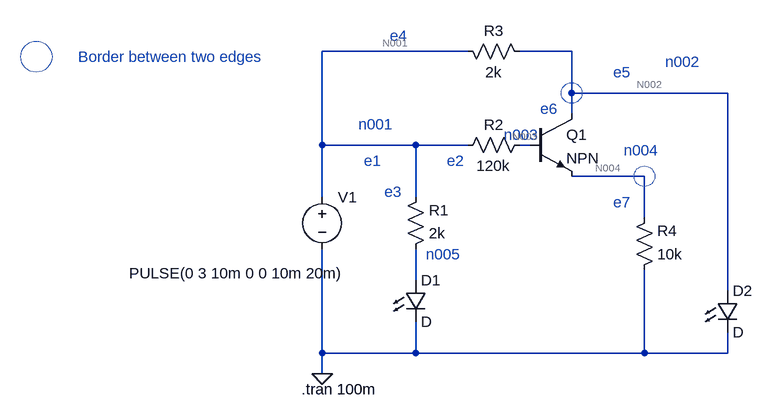
[diagram p0: schematic D-33_v-4-1_1_Tr-inverter__v2.asc]
D-33_v-4-1_1_Tr-inverter__v2.asc, the LTspice schematic file:
Version 4
SHEET 1 880 680
WIRE 192 -32 -32 -32
WIRE 352 -32 272 -32
WIRE 352 32 352 -32
WIRE 592 32 352 32
WIRE 352 64 352 32
WIRE -32 112 -32 -32
WIRE 112 112 -32 112
WIRE 192 112 112 112
WIRE 288 112 272 112
WIRE 464 160 352 160
WIRE -32 192 -32 112
WIRE 112 192 112 112
WIRE 464 224 464 160
WIRE 112 320 112 272
WIRE 592 336 592 32
WIRE -32 432 -32 272
WIRE 112 432 112 384
WIRE 112 432 -32 432
WIRE 464 432 464 304
WIRE 464 432 112 432
WIRE 592 432 592 400
WIRE 592 432 464 432
WIRE -32 464 -32 432
FLAG -32 464 0
SYMBOL npn2 288 64 R0
SYMATTR InstName Q1
SYMBOL res 96 288 M180
WINDOW 0 36 76 Left 2
WINDOW 3 36 40 Left 2
SYMATTR InstName R1
SYMATTR Value 2k
SYMBOL res 288 -16 M270
WINDOW 0 32 56 VTop 2
WINDOW 3 0 56 VBottom 2
SYMATTR InstName R3
SYMATTR Value 2k
SYMBOL res 448 320 M180
WINDOW 0 36 76 Left 2
WINDOW 3 36 40 Left 2
SYMATTR InstName R4
SYMATTR Value 10k
SYMBOL LED 96 320 R0
SYMATTR InstName D1
SYMBOL LED 576 336 R0
SYMATTR InstName D2
SYMBOL voltage -32 176 R0
WINDOW 3 -297 133 Left 2
WINDOW 123 0 0 Left 2
WINDOW 39 0 0 Left 2
SYMATTR Value PULSE(0 3 10m 0 0 10m 20m)
SYMATTR InstName V1
SYMBOL res 176 128 R270
WINDOW 0 32 56 VTop 2
WINDOW 3 0 56 VBottom 2
SYMATTR InstName R2
SYMATTR Value 120k
TEXT -64 488 Left 2 !.tran 100m
TEXT 496 -16 Left 2 ;n002
TEXT 248 96 Left 2 ;n003
TEXT 432 120 Left 2 ;n004
TEXT 24 80 Left 2 ;n001
TEXT 128 280 Left 2 ;n005
TEXT 32 136 Left 2 ;e1
TEXT 160 136 Left 2 ;e2
TEXT 64 184 Left 2 ;e3
TEXT 72 -56 Left 2 ;e4
TEXT 416 0 Left 2 ;e5
TEXT 304 56 Left 2 ;e6
TEXT 416 200 Left 2 ;e7
TEXT -408 -24 Left 2 ;Border between two edges
CIRCLE Normal 480 176 448 144 2
CIRCLE Normal 368 48 336 16 2
CIRCLE Normal -448 0 -496 -48 2

The netlist it stands for:
* D-33_v-4-1_1_Tr-inverter__v2.asc
Q1 N002 N003 N004 0 NPN
R1 N005 N001 2k
R3 N002 N001 2k
R4 0 N004 10k
D1 N005 0 D
D2 N002 0 D
V1 N001 0 PULSE(0 3 10m 0 0 10m 20m)
R2 N001 N003 120k
.model D D
.lib standard.dio
.model NPN NPN
.model PNP PNP
.lib standard.bjt
.tran 100m
* n002
* n003
* n004
* n001
* n005
* e1
* e2
* e3
* e4
* e5
* e6
* e7
* Border between two edges
.backanno
.end

* Results of the author's LTspice run, read from the files saved beside the schematic
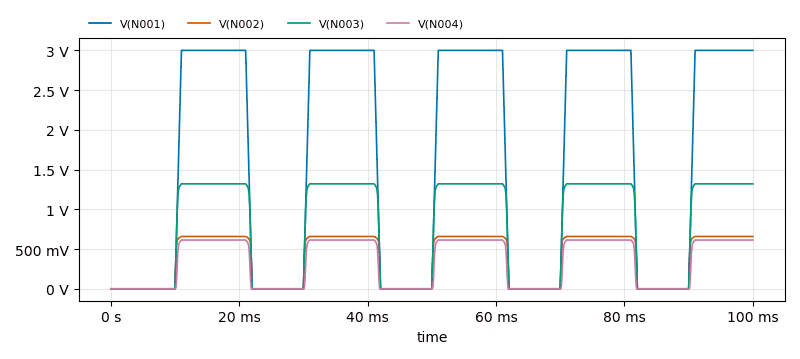
[diagram p1: Transient Analysis of D-33_v-4-1_1_Tr-inverter__v2.asc, plotted from the saved traces]
* Transient Analysis, 1 run:
*   V(N001): min 0 V, max 3 V, average 1.605 V, rms 2.164 V, last 3 V
*   V(N002): min 0 V, max 658.1 mV, average 372.6 mV, rms 492.4 mV, last 658.1 mV
*   V(N003): min 0 V, max 1.321 V, average 736.2 mV, rms 978.4 mV, last 1.321 V
*   V(N004): min 0 V, max 613.7 mV, average 335.4 mV, rms 450.6 mV, last 613.7 mV